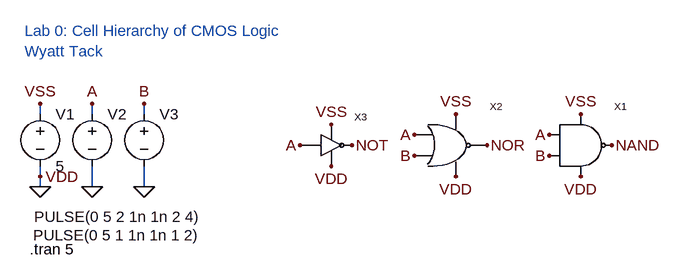
[diagram p0: schematic Lab 0 Logic Hierarchial Blocks.asc]
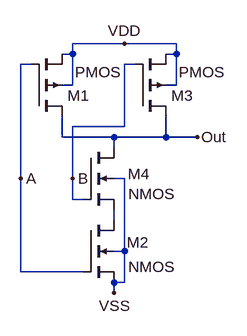
[diagram p1: sub-circuit nand.asc]
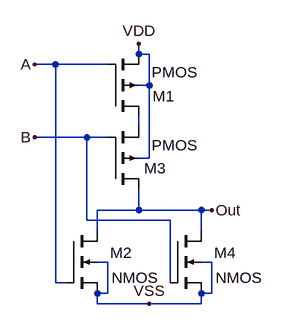
[diagram p2: sub-circuit nor.asc]
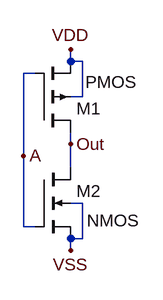
[diagram p3: sub-circuit not.asc]
Lab 0 Logic Hierarchial Blocks.asc, the LTspice schematic file:
Version 4
SHEET 1 936 680
WIRE -80 96 -80 80
WIRE 0 96 0 80
WIRE 80 96 80 80
WIRE -80 192 -80 176
WIRE -80 208 -80 192
WIRE 0 208 0 176
WIRE 80 208 80 176
FLAG -80 80 VSS
FLAG -80 192 VDD
FLAG -80 208 0
FLAG 0 80 A
FLAG 0 208 0
FLAG 80 80 B
FLAG 80 208 0
FLAG 560 96 VSS
FLAG 560 192 VDD
FLAG 496 160 B
FLAG 496 128 A
FLAG 320 144 A
FLAG 368 112 VSS
FLAG 368 176 VDD
FLAG 752 96 VSS
FLAG 752 192 VDD
FLAG 704 128 A
FLAG 704 160 B
FLAG 400 144 NOT
FLAG 608 144 NOR
FLAG 800 144 NAND
SYMBOL voltage -80 80 R0
WINDOW 123 0 0 Left 0
WINDOW 39 0 0 Left 0
SYMATTR InstName V1
SYMATTR Value 5
SYMBOL voltage 0 80 R0
WINDOW 3 -89 174 Left 2
WINDOW 123 0 0 Left 0
WINDOW 39 0 0 Left 0
SYMATTR Value PULSE(0 5 2 1n 1n 2 4)
SYMATTR InstName V2
SYMBOL voltage 80 80 R0
WINDOW 3 -171 202 Left 2
WINDOW 123 0 0 Left 0
WINDOW 39 0 0 Left 0
SYMATTR Value PULSE(0 5 1 1n 1n 1 2)
SYMATTR InstName V3
SYMBOL NAND 720 144 R0
SYMATTR InstName X1
SYMBOL NOR 512 144 R0
SYMATTR InstName X2
SYMBOL NOT 352 144 R0
SYMATTR InstName X3
TEXT -96 304 Left 2 !.tran 5
TEXT -104 -32 Left 2 ;Lab 0: Cell Hierarchy of CMOS Logic\nWyatt Tack

nand.asc, the sub-circuit schematic file:
Version 4
SHEET 1 880 680
WIRE 352 16 272 16
WIRE 432 16 352 16
WIRE 272 32 272 16
WIRE 272 32 256 32
WIRE 432 32 432 16
WIRE 432 32 416 32
WIRE 208 48 192 48
WIRE 368 48 352 48
WIRE 272 80 272 32
WIRE 272 80 256 80
WIRE 432 80 432 32
WIRE 432 80 416 80
WIRE 352 144 352 48
WIRE 352 144 272 144
WIRE 256 160 256 128
WIRE 336 160 256 160
WIRE 416 160 416 128
WIRE 416 160 336 160
WIRE 464 160 416 160
WIRE 336 176 336 160
WIRE 192 224 192 48
WIRE 272 224 272 144
WIRE 352 224 336 224
WIRE 272 256 272 224
WIRE 288 256 272 256
WIRE 336 288 336 272
WIRE 352 336 352 224
WIRE 352 336 336 336
WIRE 192 368 192 224
WIRE 288 368 192 368
WIRE 352 384 352 336
WIRE 352 384 336 384
WIRE 336 400 336 384
FLAG 336 400 VSS
FLAG 352 16 VDD
FLAG 464 160 Out
FLAG 192 224 A
FLAG 272 224 B
SYMBOL pmos4 208 128 M180
WINDOW 3 68 68 Left 2
SYMATTR InstName M1
SYMATTR Value2 l=500n w=2u
SYMBOL nmos4 288 288 R0
WINDOW 3 70 72 Left 2
WINDOW 0 68 34 Left 2
SYMATTR InstName M2
SYMBOL pmos4 368 128 M180
WINDOW 3 68 68 Left 2
SYMATTR InstName M3
SYMATTR Value2 l=500n w=2u
SYMBOL nmos4 288 176 R0
WINDOW 3 70 72 Left 2
WINDOW 0 69 41 Left 2
SYMATTR InstName M4

nor.asc, the sub-circuit schematic file:
Version 4
SHEET 1 880 680
WIRE 368 16 368 0
WIRE 384 16 368 16
WIRE 240 32 208 32
WIRE 320 32 240 32
WIRE 384 64 384 16
WIRE 384 64 368 64
WIRE 368 128 368 112
WIRE 288 144 208 144
WIRE 320 144 288 144
WIRE 384 176 384 64
WIRE 384 176 368 176
WIRE 368 256 368 224
WIRE 368 256 304 256
WIRE 464 256 368 256
WIRE 480 256 464 256
WIRE 288 272 288 144
WIRE 416 272 288 272
WIRE 304 288 304 256
WIRE 464 288 464 256
WIRE 320 336 304 336
WIRE 480 336 464 336
WIRE 240 368 240 32
WIRE 256 368 240 368
WIRE 416 368 416 272
WIRE 320 384 320 336
WIRE 320 384 304 384
WIRE 480 384 480 336
WIRE 480 384 464 384
WIRE 304 400 304 384
WIRE 384 400 304 400
WIRE 464 400 464 384
WIRE 464 400 384 400
FLAG 384 400 VSS
FLAG 368 0 VDD
FLAG 480 256 Out
FLAG 208 32 A
FLAG 208 144 B
SYMBOL pmos4 320 112 M180
WINDOW 3 68 68 Left 2
WINDOW 0 69 31 Left 2
SYMATTR InstName M1
SYMATTR Value2 l=500n w=2u
SYMBOL nmos4 256 288 R0
WINDOW 3 70 72 Left 2
WINDOW 0 68 34 Left 2
SYMATTR InstName M2
SYMBOL pmos4 320 224 M180
WINDOW 3 68 68 Left 2
SYMATTR InstName M3
SYMATTR Value2 l=500n w=2u
SYMBOL nmos4 416 288 R0
WINDOW 3 70 72 Left 2
WINDOW 0 68 34 Left 2
SYMATTR InstName M4

not.asc, the sub-circuit schematic file:
Version 4
SHEET 1 880 680
WIRE 256 32 256 16
WIRE 272 32 256 32
WIRE 208 48 192 48
WIRE 272 80 272 32
WIRE 272 80 256 80
WIRE 256 144 256 128
WIRE 192 160 192 48
WIRE 256 176 256 144
WIRE 272 224 256 224
WIRE 192 256 192 160
WIRE 208 256 192 256
WIRE 272 272 272 224
WIRE 272 272 256 272
WIRE 256 288 256 272
FLAG 256 288 VSS
FLAG 256 16 VDD
FLAG 192 160 A
FLAG 256 144 Out
SYMBOL pmos4 208 128 M180
WINDOW 3 68 68 Left 2
SYMATTR InstName M1
SYMATTR Value2 l=500n w=2u
SYMBOL nmos4 208 176 R0
WINDOW 3 70 72 Left 2
SYMATTR InstName M2

The netlist it stands for:
* Lab 0 Logic Hierarchial Blocks.asc
V1 VSS 0 5
V2 A 0 PULSE(0 5 2 1n 1n 2 4)
V3 B 0 PULSE(0 5 1 1n 1n 1 2)
XX1 A B NAND 0 VSS nand
XX2 VSS 0 NOR A B nor
XX3 VSS 0 A NOT not

* block symbol definitions
.subckt nand A B Out VSS VDD
M1 Out A VDD VDD PMOS l=500n w=2u
M2 N001 A VSS VSS NMOS
M3 Out B VDD VDD PMOS l=500n w=2u
M4 Out B N001 VSS NMOS
.ends nand

.subckt nor VDD VSS Out A B
M1 N001 A VDD VDD PMOS l=500n w=2u
M2 Out A VSS VSS NMOS
M3 Out B N001 VDD PMOS l=500n w=2u
M4 Out B VSS VSS NMOS
.ends nor

.subckt not Vdd Vss A Out
M1 Out A VDD VDD PMOS l=500n w=2u
M2 Out A VSS VSS NMOS
.ends not

.model NMOS NMOS
.model PMOS PMOS
.lib standard.mos
.tran 5
* Lab 0: Cell Hierarchy of CMOS Logic
* Wyatt Tack
.backanno
.end

* Results of the author's LTspice run, read from the files saved beside the schematic
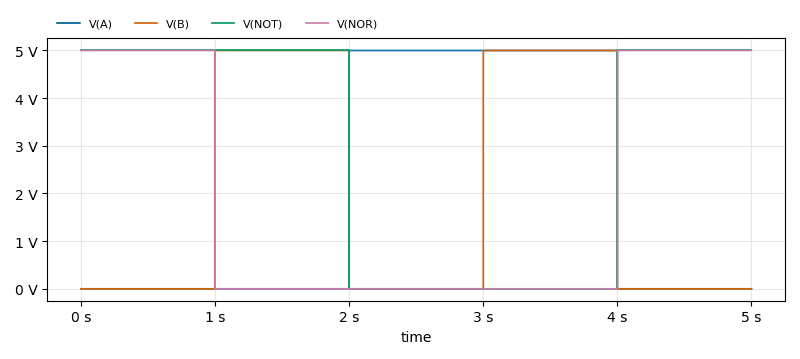
[diagram p4: Transient Analysis of Lab 0 Logic Hierarchial Blocks.asc, plotted from the saved traces]
* Transient Analysis, 1 run:
*   V(A): min 0 V, max 5 V, average 2 V, rms 3.162 V, last 0 V
*   V(B): min 0 V, max 5 V, average 2 V, rms 3.162 V, last 0 V
*   V(NOT): min 0 V, max 5 V, average 3 V, rms 3.873 V, last 5 V
*   V(NOR): min 0 V, max 5.002 V, average 2 V, rms 3.162 V, last 5 V